# EAGLE design Triggerboard_SOP (EAGLE 9.6.2)
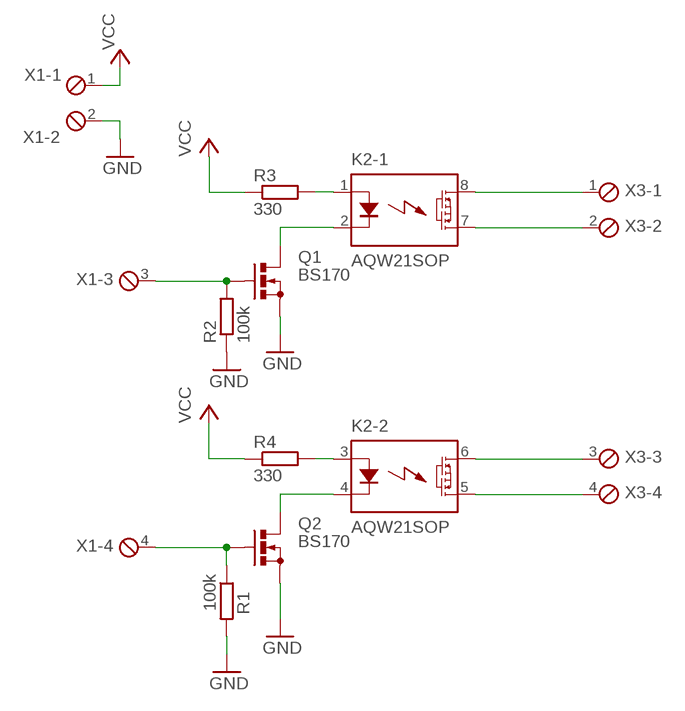
[diagram p0: schematic, sheet 1]

## Parts
K2  AQW21SOP  [SOP08]
Q1  BS170  [SOT54E]
Q2  BS170  [SOT54E]
R1  100k  R-EU_0207/12  [0207/12]
R2  100k  R-EU_0207/12  [0207/12]
R3  330  R-EU_0207/12  [0207/12]
R4  330  R-EU_0207/12  [0207/12]
X1  MPT4  [4POL254]
X3  MPT4  [4POL254]

## Nets
GND: Q1.S Q2.S R1.2 R2.1 X1.2
N$1: K2.1(-1:A) R3.2
N$2: K2.3(-2:A) R4.2
N$3: Q2.G R1.1 X1.4
N$4: K2.8(-1:D1) X3.1
N$5: K2.4(-2:K) Q2.D
N$7: K2.5(-2:D2) X3.4
N$8: K2.6(-2:D1) X3.3
N$9: K2.7(-1:D2) X3.2
N$11: K2.2(-1:K) Q1.D
N$12: Q1.G R2.2 X1.3
VCC: R3.1 R4.1 X1.1

## Library data of the parts
K2 = relay:AQW*: PhotoMOS Relay NAiS Source: http://www.mew-europe.com/.. pti_en.pdf; OC_FARNELL: unknown; OC_NEWARK: unknown
Q1 Q2 = transistor-small-signal:BS170: N-CHANNEL MOS FET; MF: ON SEMICONDUCTOR; MPN: BS170; OC_NEWARK: 25M7820
R1 R2 = rcl:R-EU_: RESISTOR, European symbol; OC_NEWARK: unknown; SPICEPREFIX: R
R3 R4 = rcl:R-EU_: RESISTOR, European symbol; MF: MULTICOMP PRO; MPN: MCF 1W 330R; OC_NEWARK: 38K0418; SPICEPREFIX: R
X1 X3 = con-phoenix-254:MPT4: PHOENIX CONNECTOR; OC_FARNELL: unknown; OC_NEWARK: unknown

## Net classes
0 default: width 0.305 mm, drill 0.508 mm, clearance 0.254 mm

## Board
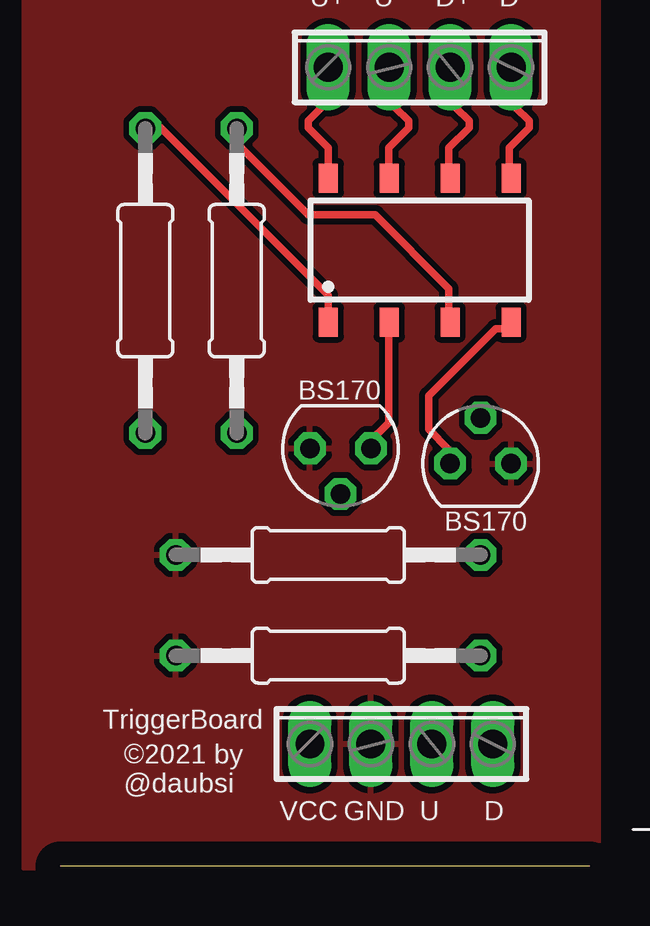
[diagram p1: board, top side]
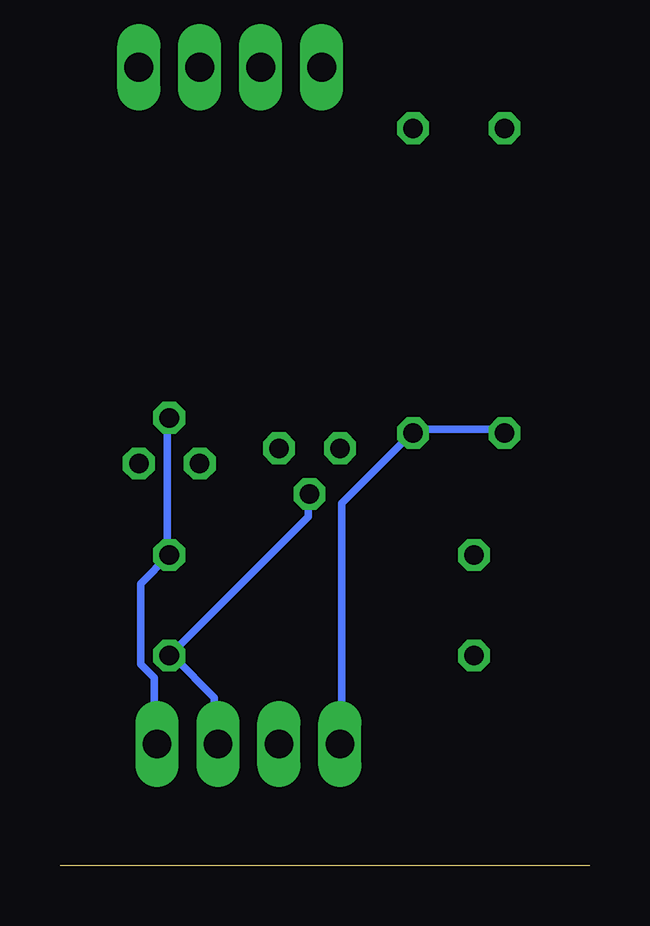
[diagram p2: board, bottom side, seen from below]

Size 22.08 x 0 mm. Coordinates in mm from the lower left corner, seen from the top.
Outline: 0,0 22.08,0
Copper layers (1*16): Top 0.035mm / dielectric 1.5mm / Bottom 0.035mm
Design rules "default": minimum track width 6mil, minimum drill 0.35mm, track to track 6mil, track to pad 6mil, pad to pad 6mil, via to via 6mil, smd to smd 6mil, copper to edge 40mil, drill to drill 6mil, minimum pad ring 10mil, minimum via ring 8mil, stop-mask expansion 4mil, vias tented up to drill 0mil, thermal gap 10mil

### Footprints (pad centres in the part's own frame; a part is rotated, then mirrored left to right if it is on the bottom)
SOP08 = smd 0.8 x 1.2: 1 -3.81,-3; 2 -1.27,-3; 3 1.27,-3; 4 3.81,-3; 5 3.81,3; 6 1.27,3; 7 -1.27,3; 8 -3.81,3
SOT54E = drill 0.813 octagon: D -1.27,0; G 0,1.905; S 1.27,0
0207/12 = drill 0.813 octagon: 1 -6.35,0; 2 6.35,0
4POL254 = drill 1.2 long: 1 -3.81,0; 2 -1.27,0; 3 1.27,0; 4 3.81,0

### Placement (x,y rotation side)
K2  14.99,25.65 0 top  (outside the outline)
Q1  11.68,17.4 180 top  (outside the outline)
Q2  17.53,16.76 0 top  (outside the outline)
R1  11.18,12.95 180 top  (outside the outline)
R2  11.18,8.76 0 top  (outside the outline)
R3  3.56,24.38 90 top  (outside the outline)
R4  7.37,24.38 90 top  (outside the outline)
X1  14.22,5.08 0 top  (outside the outline)
X3  14.99,33.27 0 top  (outside the outline)

### Tracks (layer width: path | path; a pad name or v marks a point on that pad's centre or on a via)
GND
  pour Top: -1.52,37.08 -1.52,-0.13 22.48,-0.13 22.48,37.08
N$1
  Top 0.305: K2.1 11.18,23.77 4.19,30.76 3.63,30.76 R3.2
  Bottom 0.305: 3.63,30.48 R3.2
N$2
  Top 0.305: K2.3 16.2,22.66 16.2,24.05 13.13,27.13 10.34,27.13 6.98,30.48 7.26,30.76 R4.2
  Bottom 0.305: 7.54,30.76 R4.2
N$3
  Bottom 0.305: X1.4 18.16,5.33 18.16,7.85 18.72,8.41 18.72,11.76 R1.1 17.6,13.16 17.6,18.47 Q2.G
N$4
  Top 0.305: K2.8 11.18,29.92 10.34,30.76 10.34,31.04 11.18,31.88 X3.1
N$5
  Top 0.305: K2.4 18.72,22.38 18.16,22.38 15.37,19.58 15.37,18.19 16.2,17.35 16.2,16.79 Q2.D
N$7
  Top 0.305: K2.5 18.72,28.8 18.72,29.92 19.56,30.76 19.56,31.04 19,31.6 19,33.27 X3.4
N$8
  Top 0.305: K2.6 16.2,28.8 16.2,29.92 17.04,30.76 17.04,31.04 16.48,31.6 16.48,33.27 X3.3
N$9
  Top 0.305: K2.7 13.69,28.8 13.69,29.92 14.53,30.76 14.53,31.04 13.97,31.6 13.97,33.27 X3.2
N$11
  Top 0.305: K2.2 13.69,22.38 13.69,18.47 12.85,17.63 Q1.D
N$12
  Bottom 0.305: 15.37,5.33 X1.3 15.65,5.33 15.65,7.01 17.32,8.69 R2.2 11.73,14.55 11.73,15.39 Q1.G
VCC
  Bottom 0.305: R3.1 3.63,18.19 7.26,18.19 R4.1 7.54,17.91 10.34,15.11 10.34,5.33 X1.1

### Text on the board
tNames: U+ | U- | D+ | D- | BS170 | BS170 | TriggerBoard | ©2021 by / @daubsi | VCC | GND | U | D